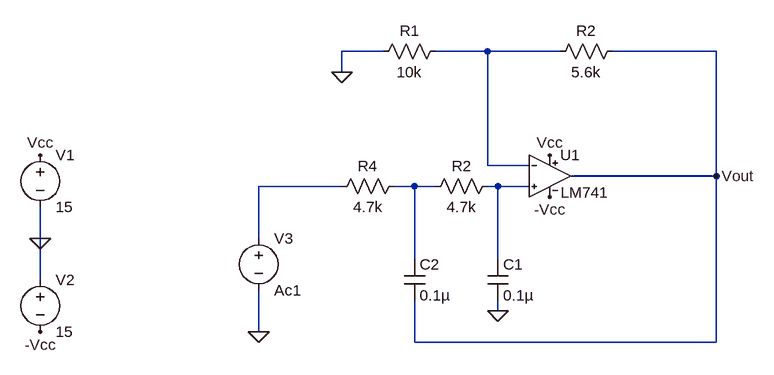
[diagram p0: schematic Draft2.asc]
Draft2.asc, the LTspice schematic file:
Version 4
SHEET 1 1164 680
WIRE 608 -80 544 -80
WIRE 768 -80 688 -80
WIRE 880 -80 768 -80
WIRE 1120 -80 960 -80
WIRE 544 -48 544 -80
WIRE 768 96 768 -80
WIRE 832 96 768 96
WIRE 1120 112 1120 -80
WIRE 1120 112 896 112
WIRE 544 128 416 128
WIRE 656 128 624 128
WIRE 688 128 656 128
WIRE 784 128 768 128
WIRE 832 128 784 128
WIRE 80 208 80 160
WIRE 416 208 416 128
WIRE 656 240 656 128
WIRE 784 240 784 128
WIRE 80 272 80 208
WIRE 784 320 784 304
WIRE 416 352 416 288
WIRE 656 368 656 304
WIRE 1120 368 1120 112
WIRE 1120 368 656 368
FLAG 80 208 0
FLAG 80 80 Vcc
FLAG 80 352 -Vcc
FLAG 416 352 0
FLAG 864 80 Vcc
FLAG 864 144 -Vcc
FLAG 784 320 0
FLAG 544 -48 0
FLAG 1120 112 Vout
SYMBOL voltage 80 64 R0
WINDOW 123 0 0 Left 0
WINDOW 39 0 0 Left 0
SYMATTR InstName V1
SYMATTR Value 15
SYMBOL voltage 80 256 R0
WINDOW 123 0 0 Left 0
WINDOW 39 0 0 Left 0
SYMATTR InstName V2
SYMATTR Value 15
SYMBOL voltage 416 192 R0
WINDOW 123 0 0 Left 0
WINDOW 39 0 0 Left 0
SYMATTR InstName V3
SYMATTR Value Ac1
SYMBOL res 640 112 R90
WINDOW 0 0 56 VBottom 2
WINDOW 3 32 56 VTop 2
SYMATTR InstName R4
SYMATTR Value 4.7k
SYMBOL res 784 112 R90
WINDOW 0 0 56 VBottom 2
WINDOW 3 32 56 VTop 2
SYMATTR InstName R2
SYMATTR Value 4.7k
SYMBOL LM741 864 48 R0
SYMATTR InstName U1
SYMBOL cap 640 240 R0
SYMATTR InstName C2
SYMATTR Value 0.1µ
SYMBOL cap 768 240 R0
SYMATTR InstName C1
SYMATTR Value 0.1µ
SYMBOL res 976 -96 R90
WINDOW 0 0 56 VBottom 2
WINDOW 3 32 56 VTop 2
SYMATTR InstName R2
SYMATTR Value 5.6k
SYMBOL res 704 -96 R90
WINDOW 0 0 56 VBottom 2
WINDOW 3 32 56 VTop 2
SYMATTR InstName R1
SYMATTR Value 10k

The netlist it stands for:
* Draft2.asc
V1 Vcc 0 15
V2 0 -Vcc 15
V3 N002 0 Ac1
R4 N003 N002 4.7k
R2 N004 N003 4.7k
XU1 N004 N001 Vcc -Vcc Vout LM741  ; pins In+ In- V+ V- OUT
C2 N003 Vout 0.1µ
C1 N004 0 0.1µ
R2 Vout N001 5.6k
R1 N001 0 10k
.lib LM741.lib
.backanno
.end